# Altium schematic sheet Head_Sensors.SchDoc
size A4
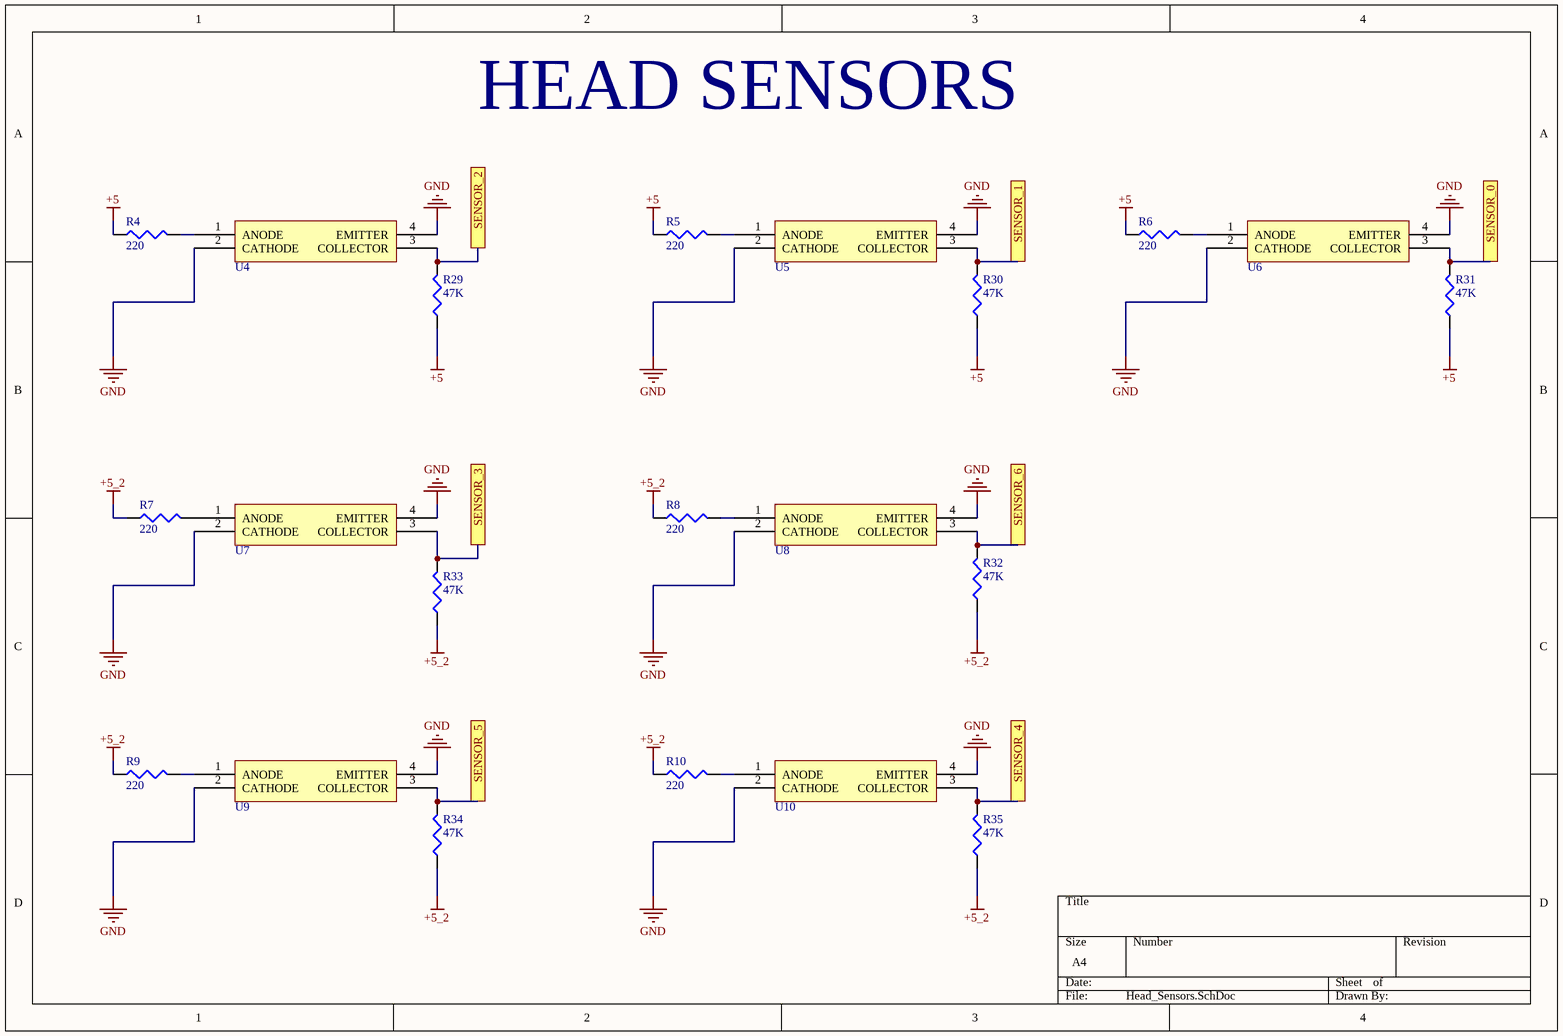
[diagram p0: Head_Sensors.SchDoc]

## Parts
R4  220  [6-0805_M]
R5  220  [6-0805_M]
R6  220  [6-0805_M]
R7  220  [6-0805_M]
R8  220  [6-0805_M]
R9  220  [6-0805_M]
R10  220  [6-0805_M]
R29  47K  [6-0805_M]
R30  47K  [6-0805_M]
R31  47K  [6-0805_M]
R32  47K  [6-0805_M]
R33  47K  [6-0805_M]
R34  47K  [6-0805_M]
R35  47K  [6-0805_M]
U4  Optical Switches  [QRE1113GR]  (value not drawn)
U5  Optical Switches  [QRE1113GR]  (value not drawn)
U6  Optical Switches  [QRE1113GR]  (value not drawn)
U7  Optical Switches  [QRE1113GR]  (value not drawn)
U8  Optical Switches  [QRE1113GR]  (value not drawn)
U9  Optical Switches  [QRE1113GR]  (value not drawn)
U10  Optical Switches  [QRE1113GR]  (value not drawn)

## Ports
SENSOR_0, SENSOR_1, SENSOR_2, SENSOR_3, SENSOR_4, SENSOR_5, SENSOR_6

## Nets
+5: R4.1 R5.1 R6.1 R29.1 R30.1 R31.1
+5_2: R7.1 R8.1 R9.1 R10.1 R32.1 R33.1 R34.1 R35.1
GND: U4.2(CATHODE) U4.4(EMITTER) U5.2(CATHODE) U5.4(EMITTER) U6.2(CATHODE) U6.4(EMITTER) U7.2(CATHODE) U7.4(EMITTER) U8.2(CATHODE) U8.4(EMITTER) U9.2(CATHODE) U9.4(EMITTER) U10.2(CATHODE) U10.4(EMITTER)
SENSOR_0: R31.2 U6.3(COLLECTOR) ; port SENSOR_0
SENSOR_1: R30.2 U5.3(COLLECTOR) ; port SENSOR_1
SENSOR_2: R29.2 U4.3(COLLECTOR) ; port SENSOR_2
SENSOR_3: R33.2 U7.3(COLLECTOR) ; port SENSOR_3
SENSOR_4: R35.2 U10.3(COLLECTOR) ; port SENSOR_4
SENSOR_5: R34.2 U9.3(COLLECTOR) ; port SENSOR_5
SENSOR_6: R32.2 U8.3(COLLECTOR) ; port SENSOR_6
NetR4_2: R4.2 U4.1(ANODE)
NetR5_2: R5.2 U5.1(ANODE)
NetR6_2: R6.2 U6.1(ANODE)
NetR7_2: R7.2 U7.1(ANODE)
NetR8_2: R8.2 U8.1(ANODE)
NetR9_2: R9.2 U9.1(ANODE)
NetR10_2: R10.2 U10.1(ANODE)

## Notes on the sheet
- HEAD SENSORS

## Library data of the parts
R4-R10 = Resistor 220 0805: RES SMD 220 OHM 1% 1/8W 0805; Manufacturer: Vishay Semiconductors; Manufacturer Part Number: CRCW0805220RFKEAC; Resistance: 220R; Power Rating: 125mW; Temperature Coefficient: 100ppm/°C; Supplier 1: Mouser; Stock 1: 36802; Pricing 1: 1=0.1, 10=0.052, 100=0.02, 500=0.012, 1000=0.006, 5000=0.005 (USD); Mount: Surface Mount; Case/Package: SMD/SMT; Contact Plating: Tin; Min Operating Temperature: -55°C; Max Operating Temperature: 155°C; Composition: Thick Film; Tolerance: 1%; Termination: Wraparound; Length: 2mm; Lead Free: Lead Free; Supplier Part Number 1: 71-CRCW0805220RFKEAC; Category: Thick Film Resistors - SMD
R29-R35 = Resistor 47K 0805: RES SMD 47K OHM 1% 1/8W 0805; Manufacturer: Vishay; Manufacturer Part Number: CRCW080547K0FKEA; Resistance: 47kR; Voltage Rating: 150V; Power Rating: 125mW; Temperature Coefficient: 100ppm/°C; Supplier 1: Mouser; Stock 1: 21962; Pricing 1: 1=0.1, 10=0.066, 50=0.066, 100=0.047, 1000=0.027, 5000=0.019, 10000=0.015, 25000=0.013, 50000=0.011, 100000=0.01 (USD); Case/Package: 0805; Weight: 0.000194oz; Case Code (Imperial): 0805; Case Code (Metric): 2012; Contact Plating: Tin; Min Operating Temperature: -55°C; Max Operating Temperature: 155°C; Tolerance: 1%; Packaging: Tape and Reel; Package Quantity: 10; Composition: Thick Film; Termination: SMD/SMT; Number of Terminations: 2; Military Standard: Not; Max Power Dissipation: 125mW; Voltage Rating (DC): 150V; Features: Automotive AEC-Q200; Working Voltage: 150V; Length: 2mm; Height: 0.45mm; Width: 1.25mm; Depth: 1.25mm; Radiation Hardening: No; REACH SVHC: Unknown; Lead Free: Lead Free; ComponentLink1URL: https://www.alliedelec.com/m/d/0c934d6939ccefa68dbe0b96d821c8cf.pdf?src-supplier=Allied+Electronics; ComponentLink1Description: https://www.alliedelec.com/m/d/0c934d6939ccefa68dbe0b96d821c8cf.pdf?src-supplier=Allied+Electronics; ComponentLink2URL: http://www.vishay.com/docs/20035/dcrcwe3.pdf?src-supplier=Digi-Key; ComponentLink2Description: http://www.vishay.com/docs/20035/dcrcwe3.pdf?src-supplier=Digi-Key; ComponentLink3URL: http://www.vishay.com/docs/20035/dcrcwe3.pdf?src-supplier=Future+Electronics; ComponentLink3Description: http://www.vishay.com/docs/20035/dcrcwe3.pdf?src-supplier=Future+Electronics; ComponentLink4URL: https://www.distrelec.biz/Web/Downloads/a_/en/flD-CRCW-e3_data_en.pdf?mime=application%2Fpdf&src-supplier=Distrelec; ComponentLink4Description: https://www.distrelec.biz/Web/Downloads/a_/en/flD-CRCW-e3_data_en.pdf?mime=application%2Fpdf&src-supplier=Distrelec; ComponentLink5URL: http://www.farnell.com/datasheets/2310790.pdf?src-supplier=Element14; ComponentLink5Description: http://www.farnell.com/datasheets/2310790.pdf?src-supplier=Element14; ComponentLink6URL: http://www.vishay.com/docs/20035/dcrcwe3.pdf?src-supplier=Avnet; ComponentLink6Description: http://www.vishay.com/docs/20035/dcrcwe3.pdf?src-supplier=Avnet; ComponentLink7URL: http://uk.rs-online.com/webdocs/0d98/0900766b80d98b26.pdf?src-supplier=RSComponents; ComponentLink7Description: http://uk.rs-online.com/webdocs/0d98/0900766b80d98b26.pdf?src-supplier=RSComponents; ComponentLink8URL: http://www.vishay.com/docs/20035/dcrcwe3.pdf?src-supplier=Avnet+Europe; ComponentLink8Description: http://www.vishay.com/docs/20035/dcrcwe3.pdf?src-supplier=Avnet+Europe; ComponentLink9URL: http://www.farnell.com/datasheets/2046716.pdf?src-supplier=Element14; ComponentLink9Description: http://www.farnell.com/datasheets/2046716.pdf?src-supplier=Element14; Supplier Part Number 1: 71-CRCW0805-47K-E3; Category: Thick Film Resistors - SMD
U4-U10 = Optical Switches: SENSOR OPTO TRANS REFL SMD PHOTO; Manufacturer: ON Semiconductor / Fairchild; Wavelength: 940nm; Forward Current: 50mA; Rise Time: 20us; Forward Voltage: 1.2V; Sensing Distance: 0.197inch; Collector Emitter Voltage (VCEO): 30V; Max Collector Current: 20mA; Number of Channels: 1; Reverse Breakdown Voltage: 5V; Power Dissipation: 75mW; Operating Supply Voltage: 1.7V; Output Type: Phototransistor; Supplier 1: Mouser; Manufacturer Part Number: QRE1113GR; Stock 1: 10425; Pricing 1: 1=0.86, 10=0.713, 50=0.713, 100=0.46, 1000=0.368, 10000=0.3 (USD); Mount: Surface Mount; Case/Package: SMD/SMT; Number of Pins: 4; Weight: 0.078g; Contact Plating: Tin,Matte; Min Operating Temperature: -40°C; Max Operating Temperature: 85°C; Packaging: Tape and Reel; Fall Time: 20us; Package Quantity: 1000; Reverse Voltage (DC): 5V; Collector Emitter Breakdown Voltage: 30V; Response Time: 20us; Max Breakdown Voltage: 30V; Number of Elements: 1; Input Current: 50mA; Max Power Dissipation: 75mW; Length: 3.6mm; Height: 1.7mm; Width: 2.9mm; Radiation Hardening: No; REACH SVHC: No SVHC; Lead Free: Lead Free; ComponentLink1URL: http://www.farnell.com/datasheets/1725706.pdf?src-supplier=Element14; ComponentLink1Description: http://www.farnell.com/datasheets/1725706.pdf?src-supplier=Element14; ComponentLink2URL: https://www.verical.com/server-webapp/html/getDatasheet?partID=146181&src-supplier=Verical; ComponentLink2Description: https://www.verical.com/server-webapp/html/getDatasheet?partID=146181&src-supplier=Verical; ComponentLink3URL: https://www.fairchildsemi.com/datasheets/QR/QRE1113.pdf?src-supplier=Avnet; ComponentLink3Description: https://www.fairchildsemi.com/datasheets/QR/QRE1113.pdf?src-supplier=Avnet; ComponentLink4URL: http://www.fairchildsemi.com/ds/QR/QRE1113.pdf?src-supplier=Avnet+Europe; ComponentLink4Description: http://www.fairchildsemi.com/ds/QR/QRE1113.pdf?src-supplier=Avnet+Europe; ComponentLink5URL: https://www.fairchildsemi.com/datasheets/QR/QRE1113.pdf?src-supplier=Digi-Key; ComponentLink5Description: https://www.fairchildsemi.com/datasheets/QR/QRE1113.pdf?src-supplier=Digi-Key; Supplier Part Number 1: 512-QRE1113GR; Category: Optical Switches, Reflective, Phototransistor Output